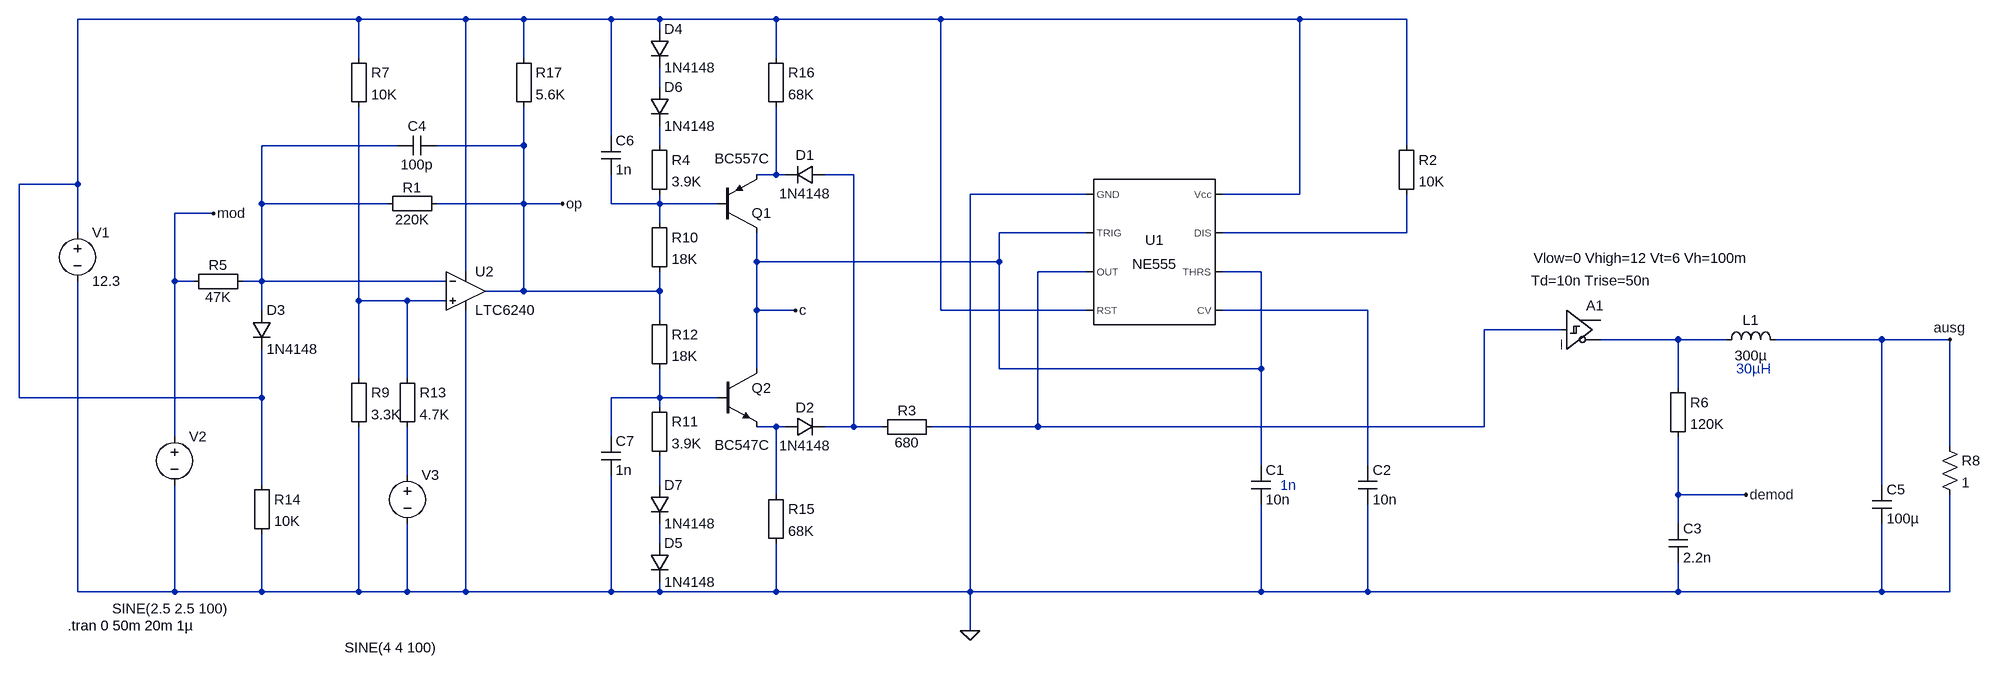
[diagram p0: schematic NE555-014.asc]
NE555-014.asc, the LTspice schematic file:
Version 4
SHEET 1 1908 904
WIRE -912 -208 -1376 -208
WIRE -736 -208 -912 -208
WIRE -640 -208 -736 -208
WIRE -496 -208 -640 -208
WIRE -416 -208 -496 -208
WIRE -224 -208 -416 -208
WIRE 48 -208 -224 -208
WIRE 640 -208 48 -208
WIRE 816 -208 640 -208
WIRE -416 -192 -416 -208
WIRE -912 -144 -912 -208
WIRE -640 -144 -640 -208
WIRE -224 -144 -224 -208
WIRE -416 -96 -416 -128
WIRE -496 -16 -496 -208
WIRE -848 0 -1072 0
WIRE -640 0 -640 -64
WIRE -640 0 -784 0
WIRE -416 0 -416 -32
WIRE 816 0 816 -208
WIRE -224 48 -224 -64
WIRE -224 48 -256 48
WIRE -208 48 -224 48
WIRE -96 48 -144 48
WIRE -1376 64 -1376 -208
WIRE -1376 64 -1472 64
WIRE 288 80 96 80
WIRE 640 80 640 -208
WIRE 640 80 512 80
WIRE -1072 96 -1072 0
WIRE -864 96 -1072 96
WIRE -640 96 -640 0
WIRE -640 96 -784 96
WIRE -576 96 -640 96
WIRE -496 96 -496 48
WIRE -416 96 -416 80
WIRE -416 96 -496 96
WIRE -320 96 -416 96
WIRE -1152 112 -1216 112
WIRE -416 128 -416 96
WIRE -1376 144 -1376 64
WIRE 288 144 144 144
WIRE 816 144 816 80
WIRE 816 144 512 144
WIRE -256 192 -256 144
WIRE 144 192 144 144
WIRE 144 192 -256 192
WIRE -736 208 -736 -208
WIRE 288 208 208 208
WIRE 576 208 512 208
WIRE -1216 224 -1216 112
WIRE -1184 224 -1216 224
WIRE -1072 224 -1072 96
WIRE -1072 224 -1104 224
WIRE -768 224 -1072 224
WIRE -640 240 -640 96
WIRE -640 240 -704 240
WIRE -416 240 -416 208
WIRE -416 240 -640 240
WIRE -912 256 -912 -64
WIRE -832 256 -912 256
WIRE -768 256 -832 256
WIRE -1072 272 -1072 224
WIRE -256 272 -256 192
WIRE -192 272 -256 272
WIRE 48 272 48 -208
WIRE 288 272 48 272
WIRE 752 272 512 272
WIRE -416 288 -416 240
WIRE 1072 304 944 304
WIRE 1264 320 1136 320
WIRE 1344 320 1264 320
WIRE 1600 320 1424 320
WIRE 1712 320 1600 320
WIRE -256 368 -256 272
WIRE 144 368 144 192
WIRE 576 368 576 208
WIRE 576 368 144 368
WIRE -912 384 -912 256
WIRE -832 384 -832 256
WIRE 1264 400 1264 320
WIRE -1472 416 -1472 64
WIRE -1072 416 -1072 336
WIRE -1072 416 -1472 416
WIRE -416 416 -416 368
WIRE -416 416 -496 416
WIRE -320 416 -416 416
WIRE -416 432 -416 416
WIRE -224 464 -256 464
WIRE -208 464 -224 464
WIRE -96 464 -96 48
WIRE -96 464 -144 464
WIRE -48 464 -96 464
WIRE 208 464 208 208
WIRE 208 464 32 464
WIRE 944 464 944 304
WIRE 944 464 208 464
WIRE -1216 480 -1216 224
WIRE -496 480 -496 416
WIRE 1712 496 1712 320
WIRE 576 528 576 368
WIRE 752 528 752 272
WIRE -832 544 -832 464
WIRE -1072 560 -1072 416
WIRE -416 560 -416 512
WIRE 1600 560 1600 320
WIRE -224 576 -224 464
WIRE 1264 576 1264 480
WIRE 1376 576 1264 576
WIRE 1264 624 1264 576
WIRE -416 656 -416 624
WIRE -1376 736 -1376 224
WIRE -1216 736 -1216 560
WIRE -1216 736 -1376 736
WIRE -1072 736 -1072 640
WIRE -1072 736 -1216 736
WIRE -912 736 -912 464
WIRE -912 736 -1072 736
WIRE -832 736 -832 624
WIRE -832 736 -912 736
WIRE -736 736 -736 272
WIRE -736 736 -832 736
WIRE -496 736 -496 544
WIRE -496 736 -736 736
WIRE -416 736 -416 720
WIRE -416 736 -496 736
WIRE -224 736 -224 656
WIRE -224 736 -416 736
WIRE 96 736 96 80
WIRE 96 736 -224 736
WIRE 576 736 576 592
WIRE 576 736 96 736
WIRE 752 736 752 592
WIRE 752 736 576 736
WIRE 1264 736 1264 688
WIRE 1264 736 752 736
WIRE 1600 736 1600 624
WIRE 1600 736 1264 736
WIRE 1712 736 1712 576
WIRE 1712 736 1600 736
WIRE 96 800 96 736
FLAG 96 800 0
FLAG 1376 576 demod
FLAG 1712 320 ausg
FLAG -192 272 c
FLAG -1152 112 mod
FLAG -576 96 op
SYMBOL Misc\\NE555 400 176 R0
SYMATTR InstName U1
SYMBOL voltage -1376 128 R0
WINDOW 123 0 0 Left 0
WINDOW 39 0 0 Left 0
SYMATTR InstName V1
SYMATTR Value 12.3
SYMBOL cap 560 528 R0
SYMATTR InstName C1
SYMATTR Value 10n
SYMBOL voltage -1216 464 R0
WINDOW 123 0 0 Left 0
WINDOW 39 0 0 Left 0
WINDOW 3 -103 300 Left 2
SYMATTR Value SINE(2.5 2.5 100)
SYMATTR InstName V2
SYMBOL Misc\\EuropeanResistor 1248 384 R0
SYMATTR InstName R6
SYMATTR Value 120K
SYMBOL cap 1248 624 R0
SYMATTR InstName C3
SYMATTR Value 2.2n
SYMBOL Digital\\schmitt 1072 240 R0
WINDOW 39 -46 -54 Left 2
WINDOW 40 -50 -17 Left 2
SYMATTR SpiceLine Vlow=0 Vhigh=12 Vt=6 Vh=100m
SYMATTR SpiceLine2 Td=10n Trise=50n
SYMATTR InstName A1
SYMBOL cap 736 528 R0
SYMATTR InstName C2
SYMATTR Value 10n
SYMBOL Misc\\EuropeanResistor 800 -16 R0
SYMATTR InstName R2
SYMATTR Value 10K
SYMBOL ind 1328 336 R270
WINDOW 0 32 56 VTop 2
WINDOW 3 5 56 VBottom 2
SYMATTR InstName L1
SYMATTR Value 300µ
SYMBOL cap 1584 560 R0
SYMATTR InstName C5
SYMATTR Value 100µ
SYMBOL res 1696 480 R0
SYMATTR InstName R8
SYMATTR Value 1
SYMBOL pnp -320 144 M180
WINDOW 3 -5 122 Left 2
SYMATTR Value BC557C
SYMATTR InstName Q1
SYMBOL npn -320 368 R0
WINDOW 3 -5 126 Left 2
SYMATTR Value BC547C
SYMATTR InstName Q2
SYMBOL Misc\\EuropeanResistor 48 448 R90
WINDOW 0 5 56 VBottom 2
WINDOW 3 27 56 VTop 2
SYMATTR InstName R3
SYMATTR Value 680
SYMBOL Misc\\EuropeanResistor -432 -16 R0
SYMATTR InstName R4
SYMATTR Value 3.9K
SYMBOL Misc\\EuropeanResistor -432 112 R0
SYMATTR InstName R10
SYMATTR Value 18K
SYMBOL Misc\\EuropeanResistor -432 416 R0
SYMATTR InstName R11
SYMATTR Value 3.9K
SYMBOL cap -512 -16 R0
SYMATTR InstName C6
SYMATTR Value 1n
SYMBOL cap -512 480 R0
SYMATTR InstName C7
SYMATTR Value 1n
SYMBOL Misc\\EuropeanResistor -432 272 R0
SYMATTR InstName R12
SYMATTR Value 18K
SYMBOL Misc\\EuropeanResistor -768 80 R90
WINDOW 0 5 56 VBottom 2
WINDOW 3 27 56 VTop 2
SYMATTR InstName R1
SYMATTR Value 220K
SYMBOL Misc\\EuropeanResistor -1088 208 R90
WINDOW 0 5 56 VBottom 2
WINDOW 3 27 56 VTop 2
SYMATTR InstName R5
SYMATTR Value 47K
SYMBOL Misc\\EuropeanResistor -928 -160 R0
SYMATTR InstName R7
SYMATTR Value 10K
SYMBOL Misc\\EuropeanResistor -928 368 R0
SYMATTR InstName R9
SYMATTR Value 3.3K
SYMBOL Misc\\EuropeanResistor -848 368 R0
SYMATTR InstName R13
SYMATTR Value 4.7K
SYMBOL diode -1088 272 R0
SYMATTR InstName D3
SYMATTR Value 1N4148
SYMBOL Misc\\EuropeanResistor -1088 544 R0
SYMATTR InstName R14
SYMATTR Value 10K
SYMBOL diode -432 -192 R0
SYMATTR InstName D4
SYMATTR Value 1N4148
SYMBOL diode -432 656 R0
SYMATTR InstName D5
SYMATTR Value 1N4148
SYMBOL diode -144 32 R90
WINDOW 0 0 32 VBottom 2
WINDOW 3 32 32 VTop 2
SYMATTR InstName D1
SYMATTR Value 1N4148
SYMBOL diode -208 480 R270
WINDOW 0 32 32 VTop 2
WINDOW 3 0 32 VBottom 2
SYMATTR InstName D2
SYMATTR Value 1N4148
SYMBOL diode -432 -96 R0
SYMATTR InstName D6
SYMATTR Value 1N4148
SYMBOL diode -432 560 R0
SYMATTR InstName D7
SYMATTR Value 1N4148
SYMBOL Misc\\EuropeanResistor -656 -160 R0
SYMATTR InstName R17
SYMATTR Value 5.6K
SYMBOL cap -784 -16 R90
WINDOW 0 0 32 VBottom 2
WINDOW 3 32 32 VTop 2
SYMATTR InstName C4
SYMATTR Value 100p
SYMBOL Opamps\\LTC6240 -736 240 R0
SYMATTR InstName U2
SYMBOL voltage -832 528 R0
WINDOW 123 0 0 Left 0
WINDOW 39 0 0 Left 0
WINDOW 3 -103 300 Left 2
SYMATTR Value SINE(4 4 100)
SYMATTR InstName V3
SYMBOL Misc\\EuropeanResistor -240 560 R0
SYMATTR InstName R15
SYMATTR Value 68K
SYMBOL Misc\\EuropeanResistor -240 -160 R0
SYMATTR InstName R16
SYMATTR Value 68K
TEXT -1392 792 Left 2 !.tran 0 50m 20m 1µ
TEXT 608 560 Left 2 ;1n
TEXT 1360 368 Left 2 ;30µH

The netlist it stands for:
* NE555-014.asc
XU1 0 c N009 N001 N011 c N008 N001 NE555  ; pins GND TRIG OUT RST CV THRS DIS Vcc
V1 N001 0 12.3
C1 c 0 10n
V2 mod 0 SINE(2.5 2.5 100)
R6 N012 demod 120K
C3 demod 0 2.2n
A1 N009 0 0 0 0 N012 0 0 SCHMITT Vlow=0 Vhigh=12 Vt=6 Vh=100m Td=10n Trise=50n
C2 N011 0 10n
R2 N001 N008 10K
L1 N012 ausg 300µ
C5 ausg 0 100µ
R8 ausg 0 1
Q1 c N007 N005 0 BC557C
Q2 c N013 N014 0 BC547C
R3 N009 N006 680
R4 N004 N007 3.9K
R10 N007 op 18K
R11 N013 N016 3.9K
C6 N001 N007 1n
C7 N013 0 1n
R12 op N013 18K
R1 op N003 220K
R5 N003 mod 47K
R7 N001 N010 10K
R9 N010 0 3.3K
R13 N010 N015 4.7K
D3 N003 N001 1N4148
R14 N001 0 10K
D4 N001 N002 1N4148
D5 N017 0 1N4148
D1 N006 N005 1N4148
D2 N014 N006 1N4148
D6 N002 N004 1N4148
D7 N016 N017 1N4148
R17 N001 op 5.6K
C4 op N003 100p
* U2: LTC6240 (symbol Opamps\LTC6240 not available, pins judged from their places): In+=N010 In-=N003 V+=N001 V-=0 OUT=op
V3 N015 0 SINE(4 4 100)
R15 N014 0 68K
R16 N001 N005 68K
.model D D
.lib standard.dio
.model NPN NPN
.model PNP PNP
.lib standard.bjt
.tran 0 50m 20m 1µ
* 1n
* 30µH
.lib NE555.sub
.backanno
.end